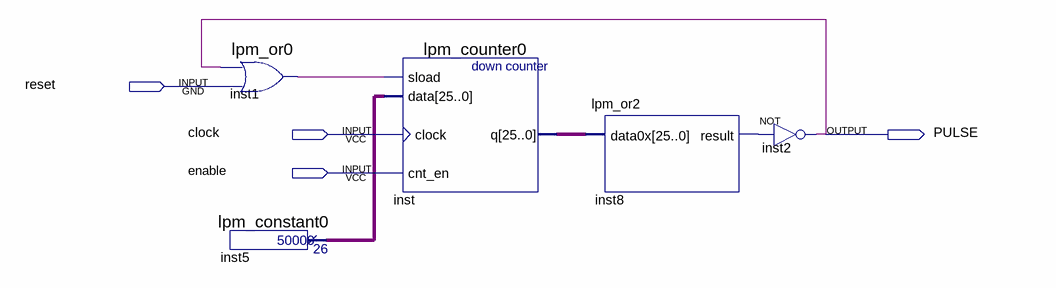
[diagram p0: schematic sheet]
// Quartus schematic g23_earth_timer.bdf as structural Verilog: 5 symbols, 4 pins
module g23_earth_timer (
  input  reset,
  input  clock,
  input  enable,
  output PULSE
);

  wire inst1_result, inst8_result;
  wire [25:0] inst5_result, inst_q;

  lpm_constant0 inst5 (.result(inst5_result));
  lpm_or0 inst1 (.data0(PULSE), .data1(reset), .result(inst1_result));
  lpm_counter0 inst (.sload(inst1_result), .data(inst5_result), .clock(clock), .cnt_en(enable), .q(inst_q));
  lpm_or2 inst8 (.data0x(inst_q), .result(inst8_result));
  not inst2 (PULSE, inst8_result);
endmodule
